# Altium schematic sheet Connectors.SchDoc
size A4; SheetNumber: 7; SheetTotal: 7
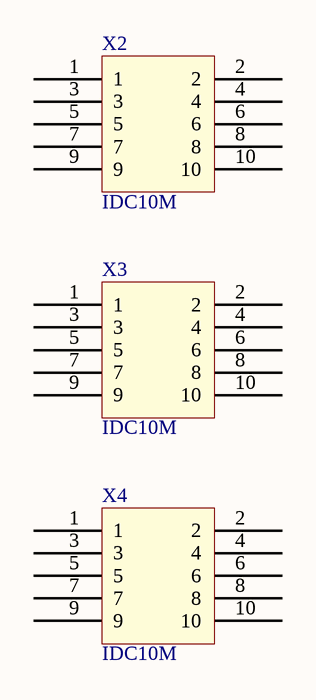
[diagram p0: Connectors.SchDoc]

## Parts
X2  IDC10M  [IDC10M]
X3  IDC10M  [IDC10M]
X4  IDC10M  [IDC10M]

## Nets

Not connected (* = marked no-connect by the designer): X2 1 2 3 4 5 6 7 8 9 10; X3 1 2 3 4 5 6 7 8 9 10; X4 1 2 3 4 5 6 7 8 9 10